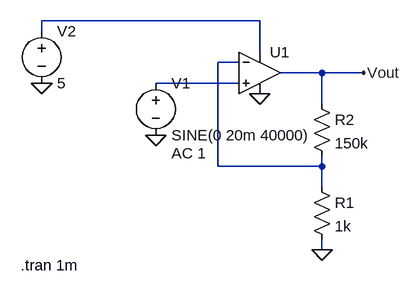
[diagram p0: schematic Amplification.asc]
Amplification.asc, the LTspice schematic file:
Version 4.1
SHEET 1 880 680
WIRE 272 32 -64 32
WIRE -64 48 -64 32
WIRE 272 80 272 32
WIRE 240 96 208 96
WIRE 368 112 304 112
WIRE 432 112 368 112
WIRE 240 128 112 128
WIRE 368 160 368 112
WIRE 208 256 208 96
WIRE 368 256 368 240
WIRE 368 256 208 256
WIRE 368 288 368 256
WIRE 368 384 368 368
FLAG 368 384 0
FLAG 432 112 Vout
FLAG 112 208 0
FLAG -64 128 0
FLAG 272 144 0
SYMBOL res 352 144 R0
SYMATTR InstName R2
SYMATTR Value 150k
SYMBOL res 352 272 R0
SYMATTR InstName R1
SYMATTR Value 1k
SYMBOL voltage 112 112 R0
WINDOW 123 24 124 Left 2
WINDOW 39 0 0 Left 0
SYMATTR Value2 AC 1
SYMATTR InstName V1
SYMATTR Value SINE(0 20m 40000)
SYMBOL voltage -64 32 R0
SYMATTR InstName V2
SYMATTR Value 5
SYMBOL OpAmps\\UniversalOpAmp 272 112 R0
SYMATTR InstName U1
TEXT -96 408 Left 2 !.tran 1m

The netlist it stands for:
* Amplification.asc
R2 Vout N002 150k
R1 N002 0 1k
V1 N003 0 SINE(0 20m 40000) AC 1
V2 N001 0 5
X§U1 N003 N002 N001 0 Vout level1 Avol=1Meg GBW=10Meg Vos=0 En=0 Enk=0 In=0 Ink=0 Rin=500Meg  ; pins In+ In- V+ V- OUT
.tran 1m
.lib UniversalOpAmp1.lib
.backanno
.end